# EAGLE design PongSat_v3r5 (EAGLE 6.2)
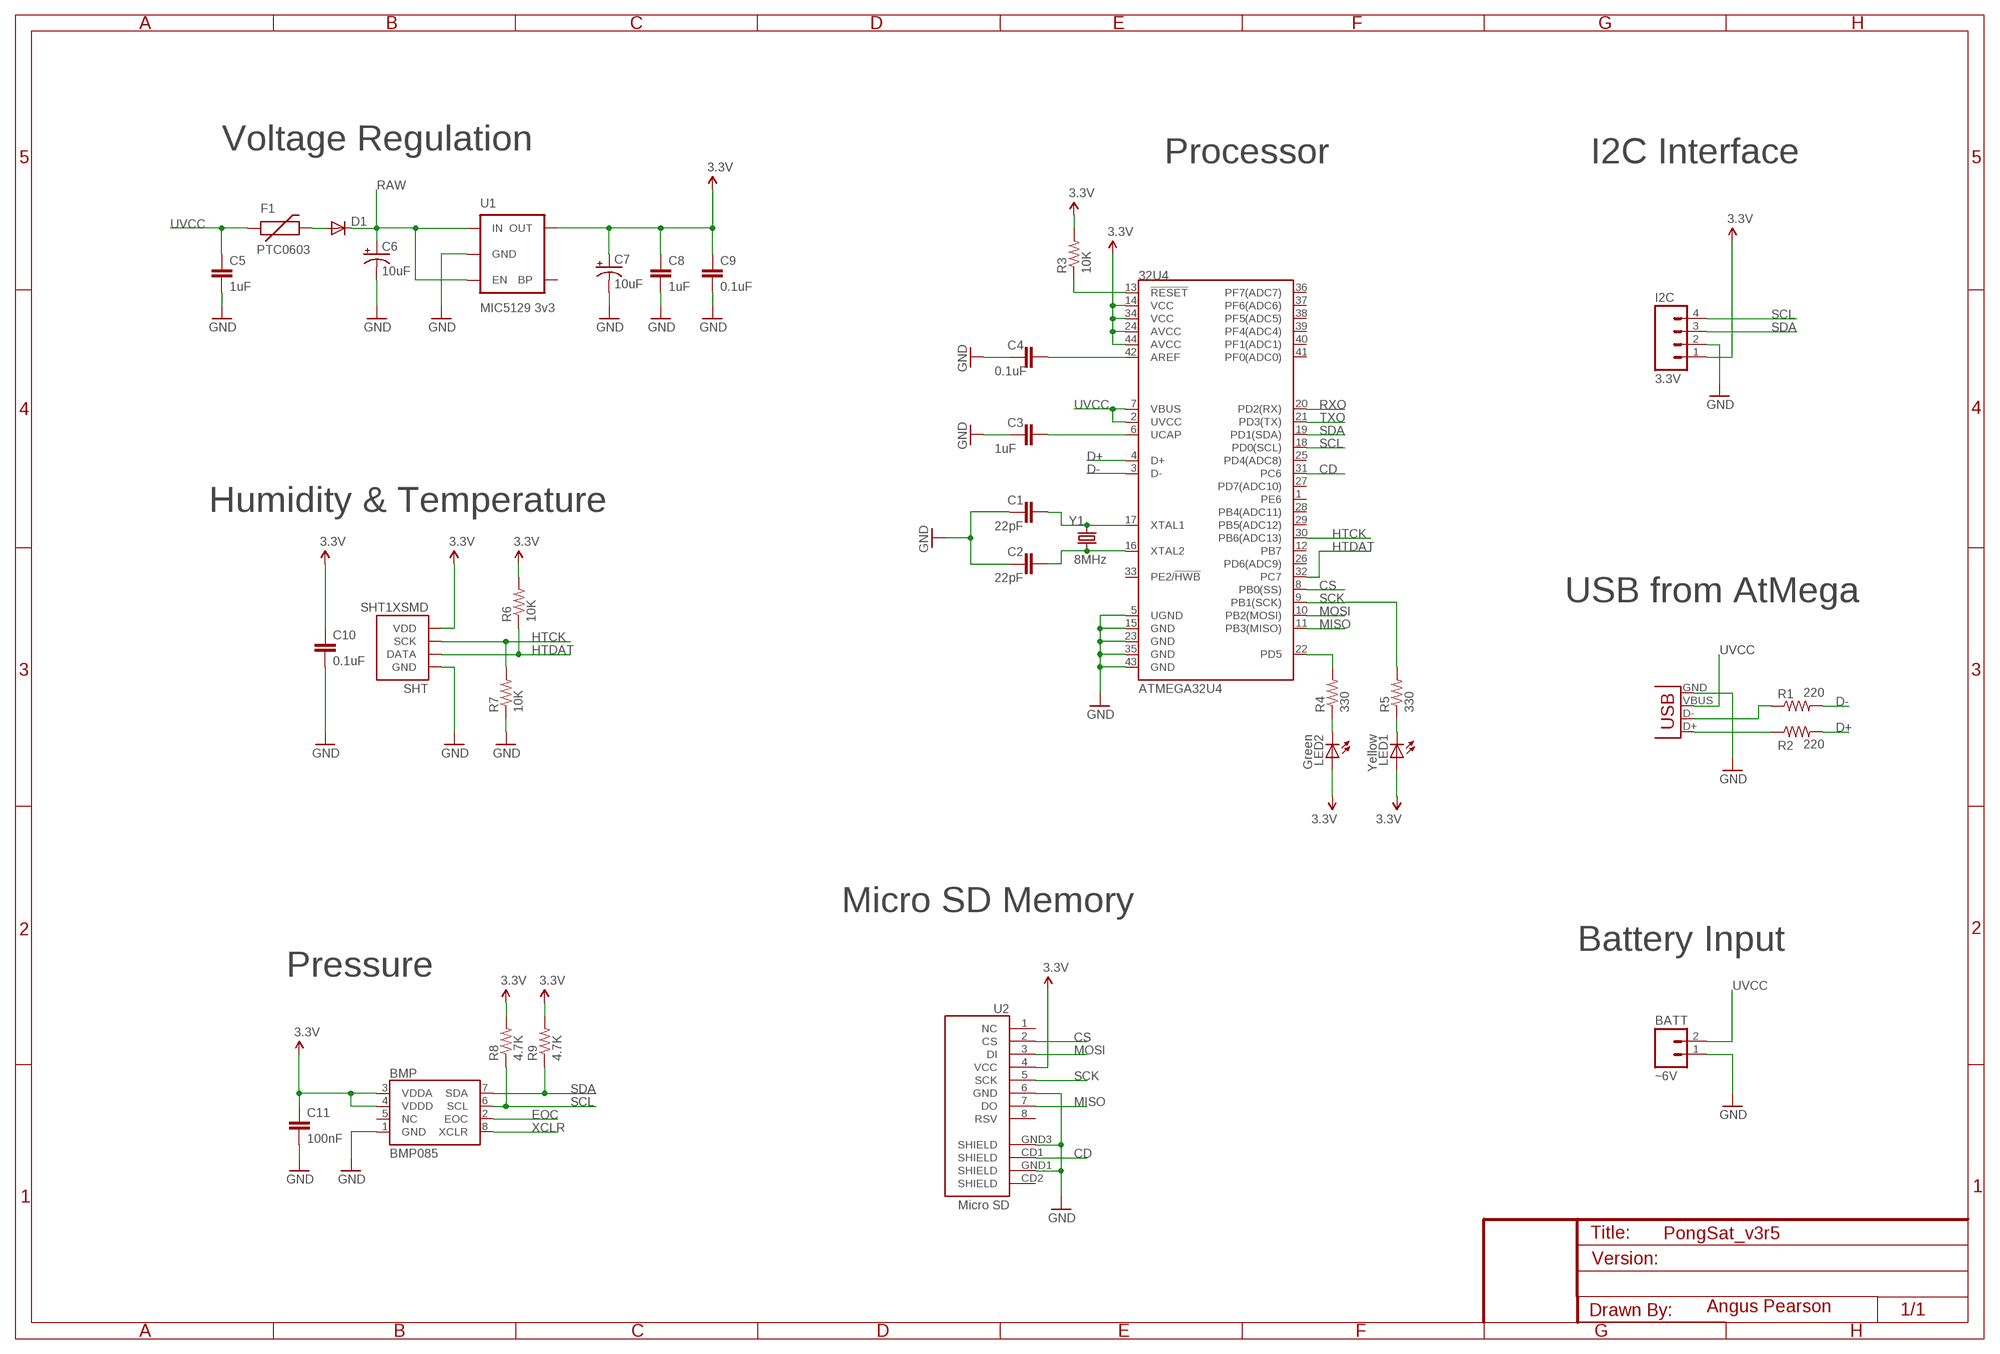
[diagram p0: schematic, sheet 1]

## Parts
32U4  ATMEGA32U4  ATMEGA32U4QFN2  [QFN-44-NOPAD]
BATT  ~6V  M02PTH  [1X02]
BMP  BMP085  [BMP085]
C1  22pF  CAP0402-CAP  [0402-CAP]
C2  22pF  CAP0402-CAP  [0402-CAP]
C3  1uF  CAP0402-CAP  [0402-CAP]
C4  0.1uF  CAP0402-CAP  [0402-CAP]
C5  1uF  CAP0402-CAP  [0402-CAP]
C6  10uF  CAP_POL1206-KIT  [EIA3216-KIT]
C7  10uF  CAP_POL1206-KIT  [EIA3216-KIT]
C8  1uF  CAP0402-CAP  [0402-CAP]
C9  0.1uF  CAP0402-CAP  [0402-CAP]
C10  0.1uF  CAP0402-CAP  [0402-CAP]
C11  100nF  CAP0402-CAP  [0402-CAP]
D1  DIODESOT23  [SOT23-3]
F1  PTC0603  [0603]
I2C  3.3V  M04PTH  [1X04]
LED1  Yellow  LED0603  [LED-0603]
LED2  Green  LED0603  [LED-0603]
R1  220  RESISTOR0402-RES  [0402-RES]
R2  220  RESISTOR0402-RES  [0402-RES]
R3  10K  RESISTOR0402-RES  [0402-RES]
R4  330  RESISTOR0402-RES  [0402-RES]
R5  330  RESISTOR0402-RES  [0402-RES]
R6  10K  RESISTOR0402-RES  [0402-RES]
R7  10K  RESISTOR0402-RES  [0402-RES]
R8  4.7K  RESISTOR0402-RES  [0402-RES]
R9  4.7K  RESISTOR0402-RES  [0402-RES]
SHT  SHT1XSMD  [SHT1X]
U1  MIC5129 3v3  V_REG_MIC5219SMD  [SOT23-5]
U2  Micro SD  USD-SOCKETNEW  [MICRO-SD-SOCKET-PP]
X1  USB-MICROB  [USB-MICROB]
Y1  8MHz  CRYSTAL5X3  [CRYSTAL-SMD-5X3]

## Nets
3.3V: 32U4.14(VCC) 32U4.24(AVCC) 32U4.34(VCC) 32U4.44(AVCC) BMP.3(VDDA) BMP.4(VDDD) C7.A(+) C8.1 C9.1 C10.1 C11.1 I2C.1 LED1.A LED2.A R3.2 R6.2 R8.2 R9.2 SHT.4(VDD) U1.5(OUT) U2.4(VCC)
CD: 32U4.31(PC6) U2.CD1(SHIELD)
CS: 32U4.8(PB0(SS)) U2.2(CS)
D+: 32U4.4(D+) R2.2
D-: 32U4.3(D-) R1.2
EOC: BMP.2(EOC)
GND: 32U4.5(UGND) 32U4.15(GND) 32U4.23(GND) 32U4.35(GND) 32U4.43(GND) BATT.1 BMP.1(GND) C1.1 C2.1 C3.1 C4.1 C5.2 C6.C(-) C7.C(-) C8.2 C9.2 C10.2 C11.2 I2C.2 R7.1 SHT.1(GND) U1.2(GND) U2.6(GND) U2.GND1(SHIELD) U2.GND3(SHIELD) X1.GND
HTCK: 32U4.30(PB6(ADC13)) R7.2 SHT.3(SCK)
HTDAT: 32U4.32(PC7) R6.1 SHT.2(DATA)
MISO: 32U4.11(PB3(MISO)) U2.7(DO)
MOSI: 32U4.10(PB2(MOSI)) U2.3(DI)
N$1: 32U4.16(XTAL2) C2.2 Y1.1
N$2: 32U4.17(XTAL1) C1.2 Y1.3
N$3: R1.1 X1.D-
N$4: R2.1 X1.D+
N$5: 32U4.6(UCAP) C3.2
N$6: LED2.C R4.1
N$7: LED1.C R5.1
N$15: 32U4.13(!RESET) R3.1
N$16: 32U4.42(AREF) C4.2
N$17: D1.1(A) F1.2
RAW: C6.A(+) D1.3(C) U1.1(IN) U1.3(EN)
RXO: 32U4.20(PD2(RX))
SCK: 32U4.9(PB1(SCK)) R5.2 U2.5(SCK)
SCL: 32U4.18(PD0(SCL)) BMP.6(SCL) I2C.4 R8.1
SDA: 32U4.19(PD1(SDA)) BMP.7(SDA) I2C.3 R9.1
TXLED: 32U4.22(PD5) R4.2
TXO: 32U4.21(PD3(TX))
UVCC: 32U4.2(UVCC) 32U4.7(VBUS) BATT.2 C5.1 F1.1 X1.VBUS
XCLR: BMP.8(XCLR)
Unconnected: 32U4.1(PE6) 32U4.12(PB7) 32U4.25(PD4(ADC8)) 32U4.26(PD6(ADC9)) 32U4.27(PD7(ADC10)) 32U4.28(PB4(ADC11)) 32U4.29(PB5(ADC12)) 32U4.33(PE2/!HWB) 32U4.36(PF7(ADC7)) 32U4.37(PF6(ADC6)) 32U4.38(PF5(ADC5)) 32U4.39(PF4(ADC4)) 32U4.40(PF1(ADC1)) 32U4.41(PF0(ADC0)) BMP.5(NC) U1.4(BP) U2.1(NC) U2.8(RSV) U2.CD2(SHIELD)

## Notes on the sheet
- Voltage Regulation
- Processor | I2C Interface
- Humidity & Temperature
- USB from AtMega
- Micro SD Memory
- Battery Input
- Pressure
- Angus Pearson

## Library data of the parts
32U4 = SparkFun-DigitalIC:ATMEGA32U4: Atmel 44-pin 8-bit Microcontroller with 32KBytes of ISP Flash and USB Controller
BATT = SparkFun-Connectors:M02: Header 2 Standard 2-pin 0.1" header. Use with straight break away headers (SKU : PRT-00116), right angle break away headers (PRT-00553), swiss pins (PRT-00743), machine pins (PRT-00117), and female headers (PRT-00115). Molex polarized connector foot print use with SKU : PRT-08233 with associated crimp pins and housings.
BMP = SparkFun-Sensors:BMP085: BMP085 Pressure Sensor Great little MEMS pressure sensor. SKU: COM-09603
C1-C5 C8-C11 = SparkFun-Passives:CAP: Capacitor Standard 0603 ceramic capacitor, and 0.1" leaded capacitor.
C6 C7 = SparkFun-Passives:CAP_POL: Capacitor Polarized These are standard SMD and PTH capacitors. Normally 10uF, 47uF, and 100uF in electrolytic and tantalum varieties. Always verify the external diameter of the through hole cap, it varies with capacity, voltage, and manufacturer. The EIA devices should be standard.
D1 = SparkFun-DiscreteSemi:DIODE: Diode These are standard reverse protection diodes and small signal diodes. SMA package can handle up to about 1A. SOD-323 can handle about 200mA. What the SOD-323 package when ordering, there are some mfgs out there that are 5-pin packages.
F1 = SparkFun-PowerIC:PTC: Resettable Fuse PTC Resettable Fuse. Spark Fun Electronics SKU : COM-08357
I2C = SparkFun-Connectors:M04: Header 4 Standard 4-pin 0.1" header. Use with straight break away headers (SKU : PRT-00116), right angle break away headers (PRT-00553), swiss pins (PRT-00743), machine pins (PRT-00117), and female headers (PRT-00115). Molex polarized connector foot print use with SKU : PRT-08231 with associated crimp pins and housings. 1MM SMD Version SKU: PRT-10208
LED1 LED2 = SparkFun-LED:LED: LEDs Standard schematic elements and footprints for 5mm, 3mm, 1206, and 0603 sized LEDs. 5mm - Spark Fun Electronics SKU : COM-00529 (and others)
R1-R9 = SparkFun-Passives:RESISTOR: Resistor Basic schematic elements and footprints for 0603, 1206, and PTH resistors.
SHT = SparkFun-Sensors:SHT1X: SHT1x Humdity Sensor Sensirion humdity sensor. Schematic element and footprint proven. Spark Fun Electronics SKU : COM-08227
U1 = SparkFun-PowerIC:V_REG_MIC5219: V_REG MIC5219 Standard 500mA LDO voltage regulator in SOT-23 layout. Micrel part MIC5219. BP (by-pass) pin is used to lower output noise with 470pF cap, may be left open.
U2 = SparkFun-Connectors:USD-SOCKET: microSD Socket Push-push type uSD socket. Schematic element and footprint production proven. Spark Fun Electronics SKU : PRT-00127. tDoc lines correctly indicate media card edge positions when inserting (unlocked, locked, depressed).
X1 = SparkFun-Connectors:USB: USB Connectors USB-B-PTH is fully proven SKU : PRT-00139 USB-miniB is fully proven SKU : PRT-00587 USB-A-PCB is untested. USB-A-H is throughly reviewed, but untested. Spark Fun Electronics SKU : PRT-00437 USB-B-SMT is throughly reviewed, but untested. Needs silkscreen touching up. USB-A-S has not been used/tested USB-MB-H has not been used/tested
Y1 = SparkFun-FreqCtrl:CRYSTAL: Various standard crystals. Proven footprints. Spark Fun Electronics SKU : COM-00534

## Board
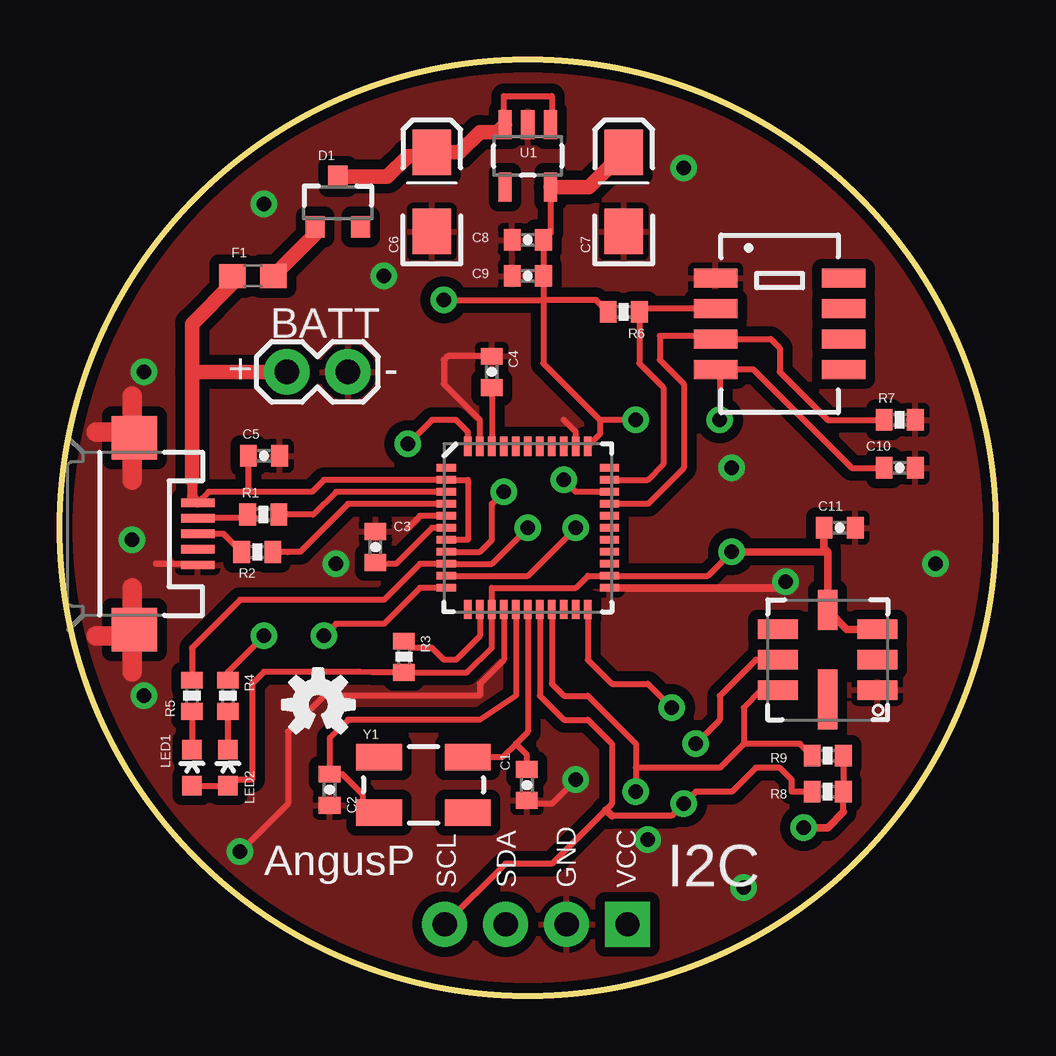
[diagram p1: board, top side]
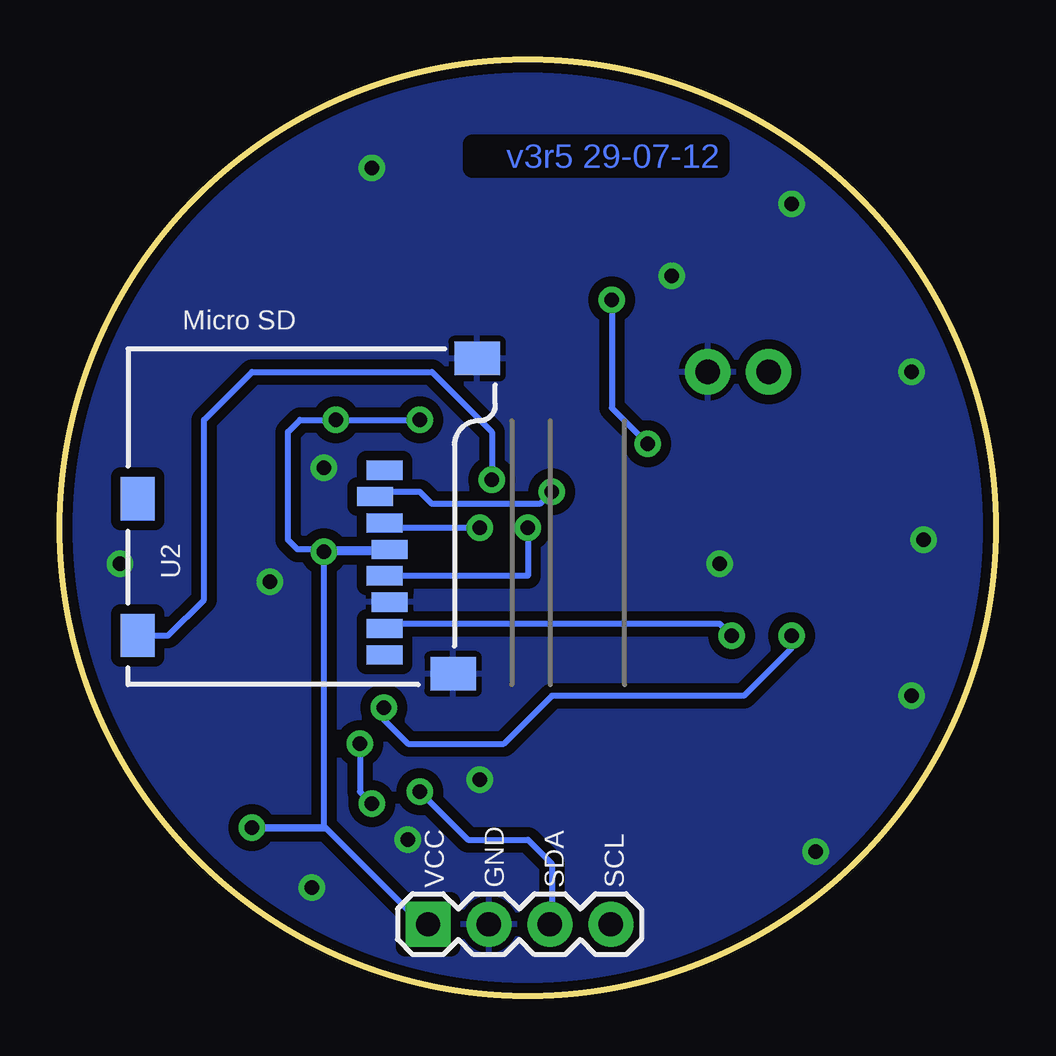
[diagram p2: board, bottom side, seen from below]

Size 39 x 39 mm. Coordinates in mm from the lower left corner, seen from the top.
Outline: circle at 19.5,19.5 radius 19.5
Copper layers (1*16): Top 0.035mm / dielectric 1.5mm / Bottom 0.035mm
Design rules: minimum track width 8mil, minimum drill 20mil, track to track 8mil, track to pad 8mil, pad to pad 8mil, via to via 8mil, smd to smd 8mil, copper to edge 10mil, drill to drill 8mil, minimum pad ring 12mil, minimum via ring 10mil, stop-mask expansion 4mil, vias tented up to drill 25mil, thermal gap 10mil

### Footprints (pad centres in the part's own frame; a part is rotated, then mirrored left to right if it is on the bottom)
QFN-44-NOPAD = smd 0.8 x 0.3: 1 -3.4,2.5; 2 -3.4,2; 3 -3.4,1.5; 4 -3.4,1; 5 -3.4,0.5; 6 -3.4,0; 7 -3.4,-0.5; 8 -3.4,-1; 9 -3.4,-1.5; 10 -3.4,-2; 11 -3.4,-2.5; 23 3.4,-2.5; 24 3.4,-2; 25 3.4,-1.5; 26 3.4,-1; 27 3.4,-0.5; 28 3.4,0; 29 3.4,0.5; 30 3.4,1; 31 3.4,1.5; 32 3.4,2; 33 3.4,2.5 | smd 0.3 x 0.8: 12 -2.5,-3.4; 13 -2,-3.4; 14 -1.5,-3.4; 15 -1,-3.4; 16 -0.5,-3.4; 17 0,-3.4; 18 0.5,-3.4; 19 1,-3.4; 20 1.5,-3.4; 21 2,-3.4; 22 2.5,-3.4; 34 2.5,3.4; 35 2,3.4; 36 1.5,3.4; 37 1,3.4; 38 0.5,3.4; 39 0,3.4; 40 -0.5,3.4; 41 -1,3.4; 42 -1.5,3.4; 43 -2,3.4; 44 -2.5,3.4
1X02 = drill 1.016 pad 1.88: 1 0,0; 2 2.54,0
BMP085 = smd 1.67 x 0.8: 1 -2.065,1.27; 2 -2.065,0; 3 -2.065,-1.27; 5 2.065,-1.27; 6 2.065,0; 7 2.065,1.27 | smd 0.8 x 1.67: 4 0,-2.065 | smd 0.8 x 2.5: 8 0,1.65
0402-CAP = smd 0.7 x 0.9: 1 -0.65,0; 2 0.65,0
EIA3216-KIT = smd 1.9 x 1.6: A 1.65,0; C -1.65,0
SOT23-3 = smd 0.8 x 0.9: 1 -0.95,-1; 2 0.95,-1; 3 0,1.1
0603 = smd 1.1 x 1: 1 -0.85,0; 2 0.85,0
1X04 = drill 1.016 pad 1.88 square: 1 0,0 | drill 1.016 pad 1.88: 2 2.54,0; 3 5.08,0; 4 7.62,0
LED-0603 = smd 0.8 x 0.8: A 0,-0.75; C 0,0.75
0402-RES = smd 0.7 x 0.9: 1 -0.65,0; 2 0.65,0
SHT1X = smd 1.8 x 0.8: 1 -2.667,1.905; 2 -2.667,0.635; 3 -2.667,-0.635; 4 -2.667,-1.905; 5 2.667,-1.905; 6 2.667,-0.635; 7 2.667,0.635; 8 2.667,1.905
SOT23-5 = smd 0.55 x 1.2: 1 -0.95,-1.3; 2 0,-1.3; 3 0.95,-1.3; 4 0.95,1.3; 5 -0.95,1.3
MICRO-SD-SOCKET-PP = smd 0.8 x 1.5: 1 -8.94,10.7; 2 -7.84,10.3; 3 -6.74,10.7; 4 -5.64,10.9; 5 -4.54,10.7; 6 -3.44,10.9; 7 -2.34,10.7; 8 -1.24,10.7 | smd 1.8 x 1.4: CD1 -2.05,0.4; CD2 -7.75,0.4 | smd 1.4 x 1.9: GND1 -13.6,14.55; GND3 -0.45,13.55
USB-MICROB = smd 0.35 x 1.4: D+ 0,2.65; D- -0.65,2.65; GND 1.3,2.65; ID 0.65,2.65; VBUS -1.3,2.65 | smd 1.8 x 1.9: MT1 -4,0; MT2 4,0
CRYSTAL-SMD-5X3 = smd 1.9 x 1.1: 1 -1.85,-1.15; 2 1.85,-1.15; 3 1.85,1.15; 4 -1.85,1.15

### Placement (x,y rotation side)
32U4  19.5,19.5 0 top
BATT  12,26 180 top
BMP  32,14 180 top
C1  19.46,8.78 90 top
C2  11.24,8.58 90 top
C3  13.15,18.7 270 top
C4  18,26 270 top
C5  8.5,22.5 0 top
C6  15.5,33.5 90 top
C7  23.5,33.5 90 top
C8  19.5,31.5 180 top
C9  19.5,30 180 top
C10  35,22 0 top
C11  32.5,19.5 0 top
D1  11.58,33.04 0 top
F1  8.04,30 0 top
I2C  23.66,2.97 0 bottom
LED1  5.5,9.5 0 top
LED2  7,9.5 0 top
R1  8.48,20.05 0 top
R2  8.23,18.49 0 top
R3  14.34,14.12 270 top
R4  7,12.5 90 top
R5  5.5,12.5 90 top
R6  23.5,28.5 180 top
R7  35,24 180 top
R8  32,8.5 0 top
R9  32,10 0 top
SHT  30,28 0 top
U1  19.5,35 180 top
U2  36.16,12.96 270 bottom
U$1  [OSHW-LOGO-S]  10.76,12.13 0 top
X1  3.1,19.25 270 top
Y1  15.15,8.78 0 top

### Tracks (layer width: path | path; a pad name or v marks a point on that pad's centre or on a via)
3.3V  (via drill 0.6)
  Top 0.254: U1.5 20.45,31.8 C8.1 C9.1 20.15,29 | LED1.A LED2.A 7.25,9 8,9 8,13 8.5,13.5 12.5,13.5 13.03,13.47 R3.2 16.97,13.47 18,14.5 32U4.14 18,17 21.5,17 22,17.5 32U4.24 27,17.5 v28,18.5 | v24,24 22.5,24 | 22.5,24 22.5,23.4 32U4.34 | 20.15,29 20.15,26.35 22.5,24 | 32U4.44 17,23.5 16.5,24 15.5,24 v14.5,23 | v16,29 20.15,29 | SHT.4 27.5,26.09 | C10.1 33,22 28.91,26.09 27.5,26.09 | 27.5,26.09 v27.5,24 | 32.65,7.65 R8.2 R9.2 | R6.2 22.35,29 20.15,29
  Top 0.305: BMP.3 32.8,15.27 BMP.4 32,18.5 | 32,18.5 v28,18.5 | C11.1 31.85,18.65 32,18.5 | 32.65,7.65 32,7 v31,7
  Top 0.61: U1.5 22.05,33.7 C7.A
  Bottom 0.254: v24,24 v27.5,24 29,24 29.5,23.5 29.5,19 29.1,18.6 U2.4 25.36,18.5 v28,18.5 28,7 27.93,7 23.9,2.97 I2C.1 | v16,29 16,24.5 v14.5,23
  Bottom 0.305: v31,7 28,7
CD  (via drill 0.6)
  Top 0.254: 32U4.31 21.5,21 v21,21.5
  Bottom 0.254: U2.CD1 34.49,15.01 33,16.5 33,24 31,26 23.5,26 21,23.5 v21,21.5
CS  (via drill 0.6)
  Top 0.254: 32U4.8 17.5,18.5 18,19 18,20.5 v18.5,21
  Bottom 0.254: v18.5,21 19,20.5 23.5,20.5 24,21 25.66,21 U2.2
D+
  Top 0.254: 32U4.4 12,20.5 10,18.5 9.49,18.49 R2.2
D-
  Top 0.254: 32U4.3 11.5,21 10.55,20.05 R1.2
GND  (via drill 0.6)
  Top 0.254: 32U4.5 15,20 14.5,19.5 | 32U4.35 21.5,23.5 21,24 | 32U4.43 17.5,24 16,25.5 16,26.5 16.15,26.65 C4.1 | 32U4.15 18.5,14 17.5,13 17.5,12.5 11,12.5 9.5,11 9.5,8 v7.5,6 | 6,18 4,18 | v21.5,9 20.5,8 19.5,8
  Top 0.305: 32U4.23 30,17 v30.25,17.25
  Top 0.813: 3,23 3,21.5 | 3,15 3,17 | 3,15 1.5,15 | 3,15 3,13.5 | 1.5,23.5 3,23.5 3,25
  other vias: 3.5,26 26,34.5 13.5,30 36.5,18 8.5,33 3.5,12.5 28.5,4.5 11.5,18 24.5,6.5 28,22 3,19
  pour Top (isolate 0.406): 0,22.5 0,17 0.5,16.5 0.5,14.5 1,14 1,13 1.5,12.5 1.5,11.5 2,11 2,10.5 2.5,10 2.5,9.5 3.5,8.5 3.5,8 7.5,4 8,4 9,3 9.5,3 10.5,2 11,2 11.5,1.5 12.5,1.5 13,1 14,1 14.5,0.5 16,0.5 16.5,0 22.5,0 23,0.5 24.5,0.5 25,1 25.5,1 26,1.5 28,1.5 29,2.5 29.5,2.5 31.5,4.5 32,4.5 35,7.5 35,8 36,9 36,9.5 37,10.5 37,11.5 37.5,12 37.5,13 38,13.5 38,14.5 38.5,15 38.5,16 39,16.5 39,22.5 38.5,23 38.5,25 38,25.5 38,26.5 37.5,27 37.5,27.5 37,28 37,28.5 36.5,29 36.5,29.5 36,30 36,30.5 30.5,36 30,36 29.5,36.5 29,36.5 28.5,37 28,37 27.5,37.5 27,37.5 26.5,38 25.5,38 25,38.5 23,38.5 22.5,39 16,39 15.5,38.5 14.5,38.5 14,38 13,38 12.5,37.5 12,37.5 11.5,37 9.5,37 9,36.5 8.5,36.5 1.5,29.5 1.5,29 2,28.5 2,27.5 1.5,27 1.5,26.5 1,26 1,25 0.5,24.5 0.5,23
  pour Bottom (isolate 0.254, hatched): 35,7.5 35,8 36,9
  pour Bottom (isolate 0.406): 0,22.5 0,17 0.5,16.5 0.5,14.5 1,14 1,13 1.5,12.5 1.5,11.5 2,11 2,10.5 2.5,10 2.5,9.5 3.5,8.5 3.5,8 7.5,4 8,4 9,3 9.5,3 10.5,2 11,2 11.5,1.5 12.5,1.5 13,1 14,1 14.5,0.5 16,0.5 16.5,0 22.5,0 23,0.5 24.5,0.5 25,1 25.5,1 26,1.5 28,1.5 29,2.5 29.5,2.5 31.5,4.5 32,4.5 35,7.5 35,8 36,9 36,9.5 37,10.5 37,11.5 37.5,12 37.5,13 38,13.5 38,14.5 38.5,15 38.5,16 39,16.5 39,22.5 38.5,23 38.5,25 38,25.5 38,26.5 37.5,27 37.5,27.5 37,28 37,28.5 36.5,29 36.5,29.5 36,30 36,30.5 30.5,36 30,36 29.5,36.5 29,36.5 28.5,37 28,37 27.5,37.5 27,37.5 26.5,38 25.5,38 25,38.5 23,38.5 22.5,39 16,39 15.5,38.5 14.5,38.5 14,38 13,38 12.5,37.5 12,37.5 11.5,37 9.5,37 9,36.5 8.5,36.5 1.5,29.5 1.5,29 2,28.5 2,27.5 1.5,27 1.5,26.5 1,26 1,25 0.5,24.5 0.5,23
HTCK
  Top 0.254: 32U4.30 24.5,20.5 26,22 26,25.5 25,26.5 25,27.5 27.2,27.5 SHT.3 29.64,27.36 30,27 30,26 32,24 R7.2
HTDAT
  Top 0.254: SHT.2 24.29,28.64 R6.1 24.15,26.35 25.15,25.35 25.15,22.15 24.5,21.5 32U4.32
MISO  (via drill 0.6)
  Top 0.254: 32U4.11 15,17 13.5,15.5 12.5,15.5 11.5,15.5 v11,15
  Bottom 0.254: v11,15 11.5,15.5 25.26,15.5 U2.7
MOSI  (via drill 0.6)
  Top 0.254: 32U4.10 19.5,17.5 v21.5,19.5
  Bottom 0.254: v21.5,19.5 25.26,19.5 U2.3
N$1
  Top 0.254: 32U4.16 19,12.5 17.5,11.5 12,11.5 11.24,10.74 C2.2 11.77,9.23 12.63,8.37 12.63,7.63 | 13.17,7.5 Y1.1 12.63,7.63 | 12.5,7.5 12.63,7.63
N$2
  Top 0.254: 17.04,9.96 Y1.3 | 17,10 Y1.3 | 19.5,9.43 C1.2 19.46,10.04 19,10.5 | 32U4.17 19.5,11 19,10.5 | 19,10.5 18.43,9.93 Y1.3
N$3
  Top 0.254: R1.1 8.18,19.9 X1.D-
N$4
  Top 0.254: R2.1 6.82,19.25 X1.D+
N$5
  Top 0.254: 32U4.6 15.5,19.5 14,18 13.2,18 C3.2
N$6
  Top 0.254: LED2.C R4.1
N$7
  Top 0.254: R5.1 LED1.C
N$15
  Top 0.254: 32U4.13 17.5,15 16.5,14 16,14 15.5,14.5 14.61,14.5 R3.1
N$16
  Top 0.254: C4.2 32U4.42
N$17
  Top 0.61: D1.1 10.63,31.74 F1.2
RAW
  Top 0.254: U1.3 18.5,36.35 18.5,37.5 20.5,37.5 20.5,36.3 U1.1
  Top 0.61: D1.3 13.64,34.14 14.5,35 15.35,35 C6.A 16.65,35.15 17.5,36 18.25,36 U1.3
SCK  (via drill 0.6)
  Top 0.254: R5.2 5.5,14.5 7.5,16.5 13.5,16.5 15,18 32U4.9 18,18 v19.5,19.5
  Bottom 0.254: v19.5,19.5 19.5,17.5 U2.5
SCL  (via drill 0.6)
  Top 0.254: 32U4.18 20,12.5 21,11.5 22,11.5 23,10.5 23,8 22.75,7.75 20.5,5.5 18.57,5.5 I2C.4 | BMP.6 29,14 27.5,12.5 27.5,11.5 v26.5,10.5 | 23,7.5 25.5,7.5 v26,8 26.5,8.5 28,8.5 29,9.5 30,9.5 30.5,9 30.5,8.5 R8.1
  Top 0.305: 23,7.5 22.75,7.75
  Bottom 0.254: v26.5,10.5 26.5,8.5 v26,8
SDA  (via drill 0.6)
  Top 0.254: 32U4.19 20.5,13 21,12.5 22,12.5 24,10.5 24,9.5 | 24,9.5 v24,8.5 | BMP.7 29.23,12.73 28.5,12 28.5,10.5 | 28.5,10.5 27.5,9.5 24,9.5 | R9.1 30.85,10.5 28.5,10.5
  Bottom 0.254: v24,8.5 22,6.5 19.5,6.5 18.5,5.5 18.5,3.05 I2C.3
TXLED  (via drill 0.6)
  Top 0.254: R4.2 7,13.5 v8.5,15 | v25.5,12 24.5,13 23,13 22,14 32U4.22
  Bottom 0.254: v8.5,15 8.5,14.5 10.5,12.5 18.5,12.5 20.5,10.5 24.5,10.5 25.5,11.5 v25.5,12
UVCC
  Top 0.254: 8,21 10.5,21 11,21.5 32U4.2 17,21.5 17,19 32U4.7 | 8,21 6.2,21 X1.VBUS | C5.1 7.85,21.15 8,21
  Top 0.406: 5.5,21.5 5.5,20.8 X1.VBUS
  Top 0.61: 5.5,26 5.5,28 7.19,29.69 F1.1 | 5.5,26 5.5,21.5 | BATT.2 5.5,26

### Text on the board
Bottom: v3r5 29-07-12
tPlace: + | - | AngusP | I2C | SCL | SDA | GND | VCC
bPlace: SCL | SDA | GND | VCC